# EAGLE design PracticeBoardV1 (EAGLE 8.2.2)
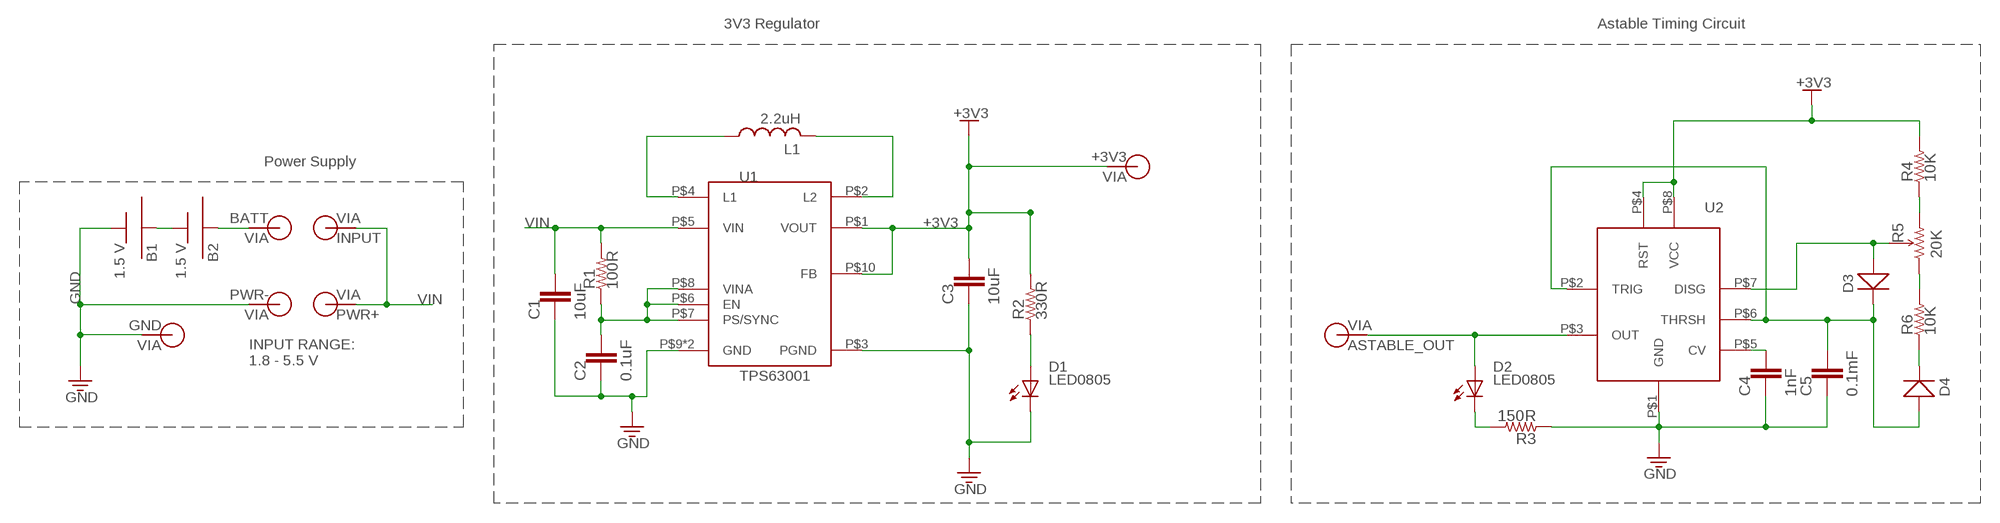
[diagram p0: schematic, sheet 1, part 1 of 2]
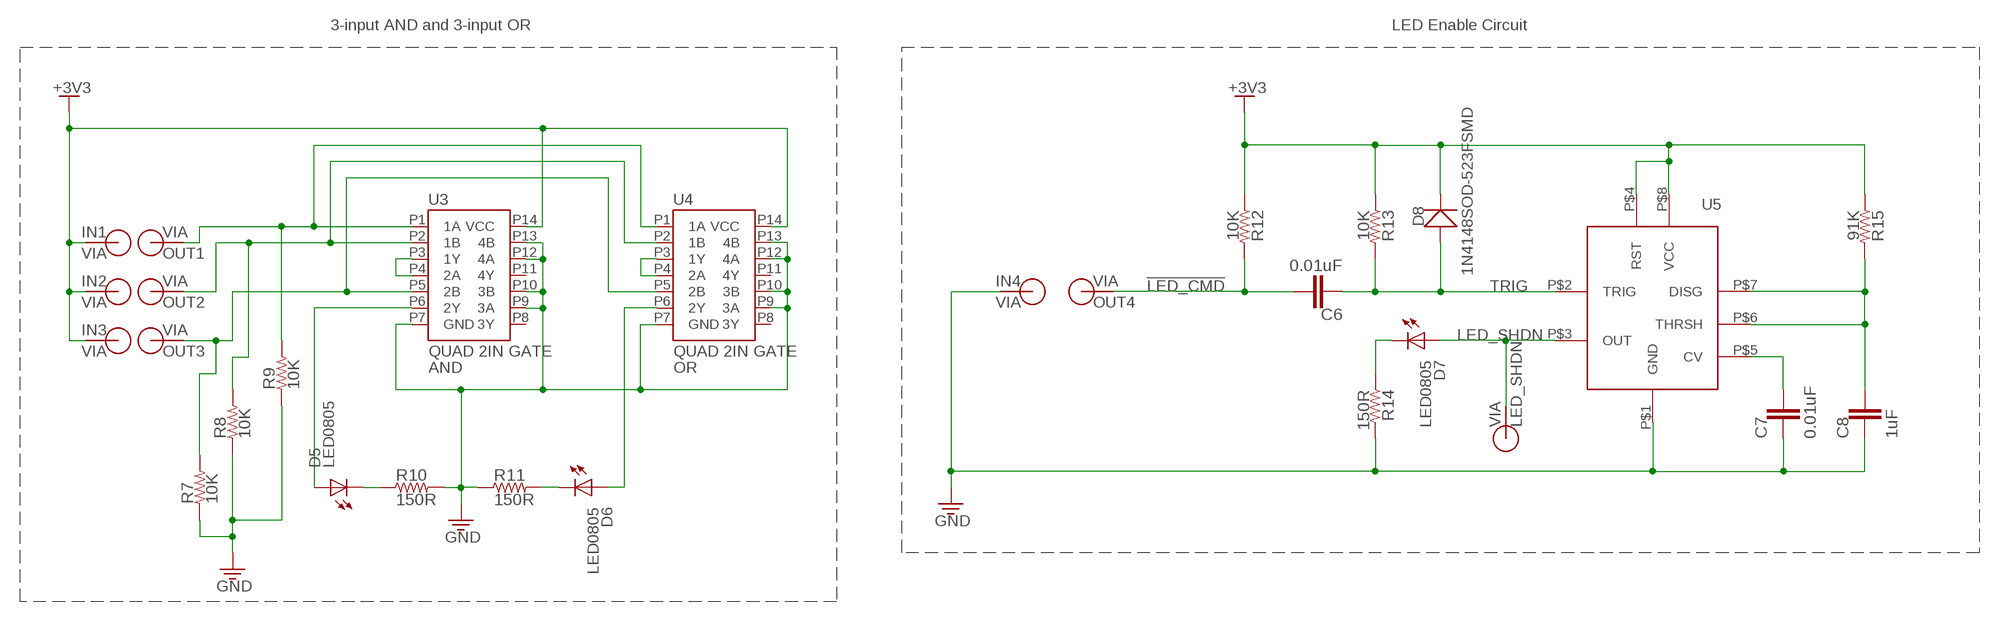
[diagram p1: schematic, sheet 1, part 2 of 2]

## Parts
B1  1.5 V  BCAAPC-BATT-HOLDER  [BCAAPC-BATT-HOLDER]
B2  1.5 V  BCAAPC-BATT-HOLDER  [BCAAPC-BATT-HOLDER]
C1  10uF  CAP0805  [0805]
C2  0.1uF  CAP0805  [0805]
C3  10uF  CAP0805  [0805]
C4  1nF  CAP0805  [0805]
C5  0.1mF  CAP0805  [0805]
C6  0.01uF  CAP0805  [0805]
C7  0.01uF  CAP0805  [0805]
C8  1uF  CAP0805  [0805]
D1  LED0805  [0805-D]
D2  LED0805  [0805-D]
D3  1N4148THRU-HOLE  [1N4148]
D4  1N4148THRU-HOLE  [1N4148]
D5  LED0805  [0805-D]
D6  LED0805  [0805-D]
D7  LED0805  [0805-D]
D8  1N4148SOD-523FSMD  [SOD-523F]
L1  2.2uH  L-USL3225M  [L3225M]
R1  100R  RES0805  [0805]
R2  330R  RES0805  [0805]
R3  150R  RES0805  [0805]
R4  10K  RES0805  [0805]
R5  20K  P160KN-0QC15B20K-POT  [P160KN]
R6  10K  RES0805  [0805]
R7  10K  RES0805  [0805]
R8  10K  RES0805  [0805]
R9  10K  RES0805  [0805]
R10  150R  RES0805  [0805]
R11  150R  RES0805  [0805]
R12  10K  RES0805  [0805]
R13  10K  RES0805  [0805]
R14  150R  RES0805  [0805]
R15  91K  RES0805  [0805]
U1  TPS63001  TPS6300X  [QFN10_POWERPAD]
U2  TLC555  [SO-8]
U3  AND  QUAD-2IN-GATE-AND-SN74AHC08RGYR  [VQFN-14]
U4  OR  QUAD-2IN-GATE-OR-SN74LV32APWRG4  [TSSOP-14]
U5  TLC555  [SO-8]
V1  BATT  VIA60MIL-SQ  [VIA-60MIL-SQ]
V2  PWR-  VIA60MIL-SQ  [VIA-60MIL-SQ]
V3  INPUT  VIA60MIL-SQ  [VIA-60MIL-SQ]
V4  PWR+  VIA60MIL-SQ  [VIA-60MIL-SQ]
V5  +3V3  VIA60MIL-SQ  [VIA-60MIL-SQ]
V6  ASTABLE_OUT  VIA60MIL-SQ  [VIA-60MIL-SQ]
V7  IN1  VIA60MIL-SQ  [VIA-60MIL-SQ]
V8  IN2  VIA60MIL-SQ  [VIA-60MIL-SQ]
V9  IN3  VIA60MIL-SQ  [VIA-60MIL-SQ]
V10  OUT1  VIA60MIL-SQ  [VIA-60MIL-SQ]
V11  OUT2  VIA60MIL-SQ  [VIA-60MIL-SQ]
V12  OUT3  VIA60MIL-SQ  [VIA-60MIL-SQ]
V13  IN4  VIA60MIL-SQ  [VIA-60MIL-SQ]
V14  OUT4  VIA60MIL-SQ  [VIA-60MIL-SQ]
V15  LED_SHDN  VIA60MIL-SQ  [VIA-60MIL-SQ]
V16  GND  VIA60MIL-SQ  [VIA-60MIL-SQ]

## Nets
!LED_CMD!: C6.1 R12.2 V14.P$1
+3V3: C3.1 D8.C R2.2 R4.2 R12.1 R13.1 R15.1 U1.P$1(VOUT) U1.P$10(FB) U2.P$4(RST) U2.P$8(VCC) U3.P14(VCC) U4.P14(VCC) U5.P$4(RST) U5.P$8(VCC) V5.P$1 V7.P$1 V8.P$1 V9.P$1
ASTABLE_OUT: D2.A U2.P$3(OUT) V6.P$1
GND: B1.MINUS C1.2 C2.2 C3.2 C4.2 C5.2 C7.2 C8.2 D1.C R3.1 R7.1 R8.1 R9.1 R10.2 R11.1 R14.2 U1.P$3(PGND) U1.P$9(GND) U1.PAD(GND) U2.P$1(GND) U3.P7(GND) U3.P9(3A) U3.P10(3B) U3.P12(4A) U3.P13(4B) U4.P7(GND) U4.P9(3A) U4.P10(3B) U4.P12(4A) U4.P13(4B) U5.P$1(GND) V2.P$1 V13.P$1 V16.P$1
LED_SHDN: D7.A U5.P$3(OUT) V15.P$1
N$1: B1.PLUS B2.MINUS
N$2: C4.1 U2.P$5(CV)
N$3: C5.1 D3.C D4.A U2.P$2(TRIG) U2.P$6(THRSH)
N$4: D5.C R10.1
N$5: L1.1 U1.P$4(L1)
N$6: L1.2 U1.P$2(L2)
N$7: R4.1 R5.P2
N$8: D6.C R11.2
N$9: C2.1 R1.1 U1.P$6(EN) U1.P$7(PS/SYNC) U1.P$8(VINA)
N$10: R9.2 U3.P1(1A) U4.P1(1A) V10.P$1
N$11: R8.2 U3.P2(1B) U4.P2(1B) V11.P$1
N$12: R7.2 U3.P5(2B) U4.P5(2B) V12.P$1
N$13: U4.P3(1Y) U4.P4(2A)
N$14: U3.P3(1Y) U3.P4(2A)
N$15: B2.PLUS V1.P$1
N$16: D3.A R5.P3 U2.P$7(DISG)
N$17: R5.P1 R6.2
N$19: D7.C R14.1
N$20: C8.1 R15.2 U5.P$6(THRSH) U5.P$7(DISG)
N$21: D5.A U3.P6(2Y)
N$22: D2.C R3.2
N$23: C7.1 U5.P$5(CV)
N$24: D6.A U4.P6(2Y)
N$25: D4.C R6.1
N$31: D1.A R2.1
TRIG: C6.2 D8.A R13.2 U5.P$2(TRIG)
VIN: C1.1 R1.2 U1.P$5(VIN) V3.P$1 V4.P$1
Unconnected: U3.P8(3Y) U3.P11(4Y) U4.P8(3Y) U4.P11(4Y)

## Notes on the sheet
- 3V3 Regulator | Astable Timing Circuit | 3-input AND and 3-input OR | LED Enable Circuit
- Power Supply
- INPUT RANGE:
  1.8 - 5.5 V

## Library data of the parts
B1 B2 = BrownSpaceEngineering:BCAAPC-BATT-HOLDER
C1-C8 = BrownSpaceEngineering:CAP: Capacitor
D1 D2 D5-D7 = BrownSpaceEngineering:LED
D3 D4 D8 = BrownSpaceEngineering:1N4148
L1 = resistor:L-US: INDUCTOR, American symbol
R1-R4 R6-R15 = BrownSpaceEngineering:RES
R5 = BrownSpaceEngineering:P160KN-0QC15B20K-POT
U1 = CNTRL_BOARD:TPS6300X
U2 U5 = BrownSpaceEngineering:TLC555
U3 U4 = BrownSpaceEngineering:QUAD-2IN-GATE
V1-V16 = BrownSpaceEngineering:VIA

## Net classes
0 default: clearance 0.205 mm

## Board
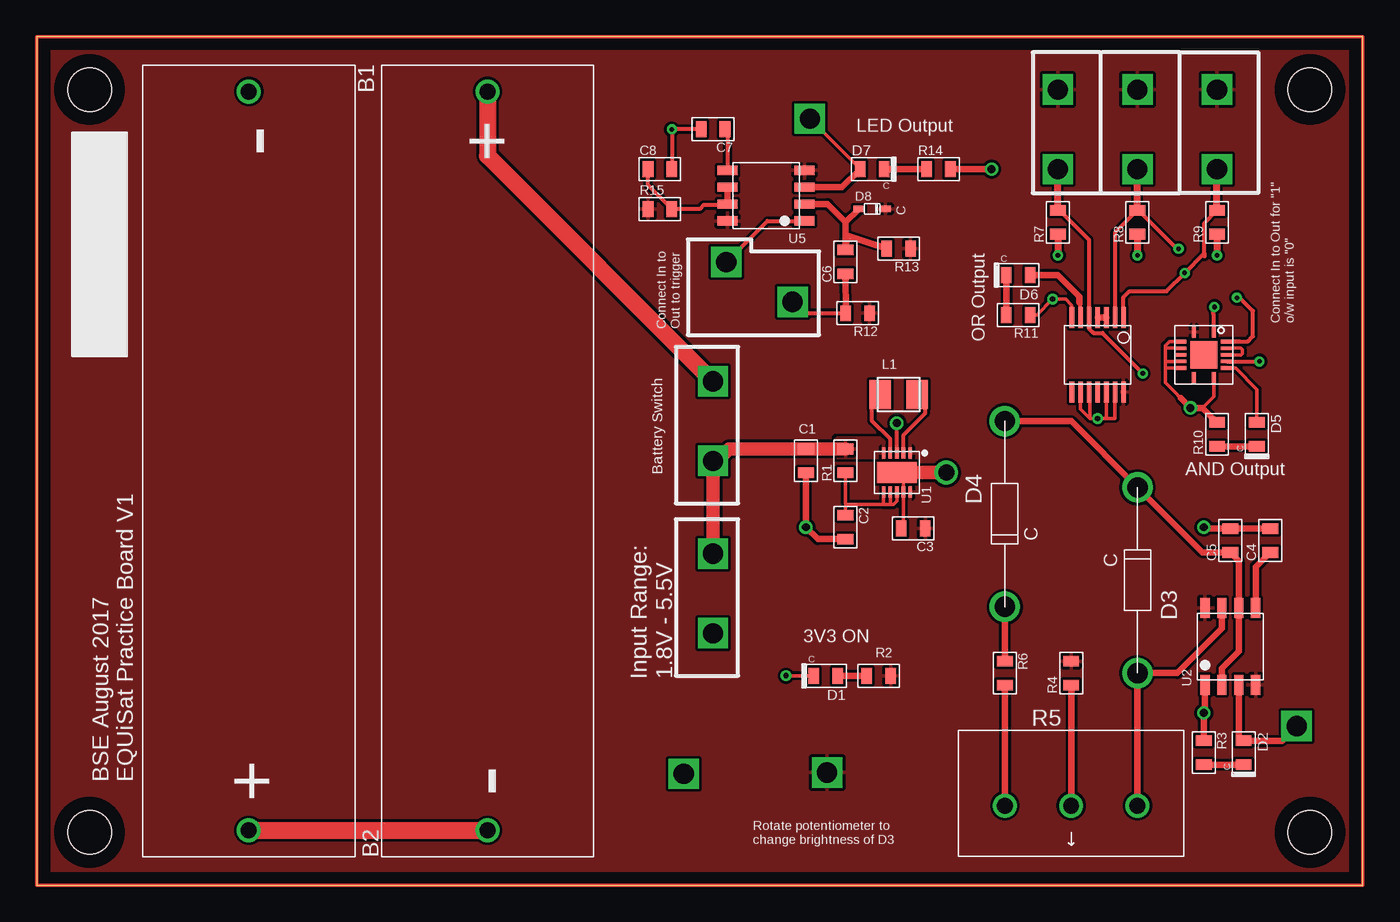
[diagram p2: board, top side]
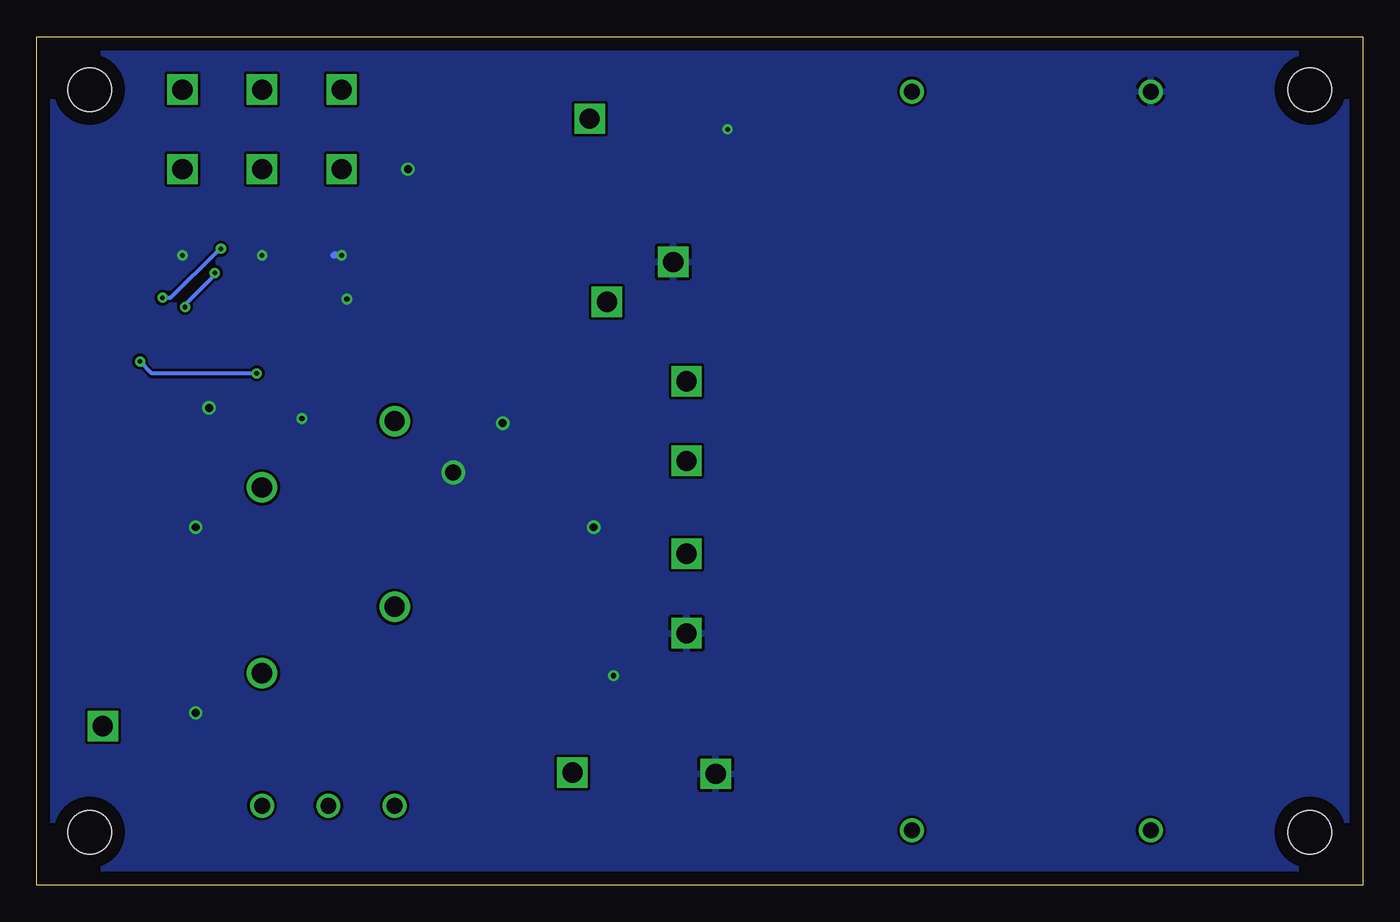
[diagram p3: board, bottom side, seen from below]

Size 100 x 64 mm. Coordinates in mm from the lower left corner, seen from the top.
Outline: 0,0 100,0 100,64 0,64 0,0
Copper layers (1*16): Top 0.035mm / dielectric 1.5mm / Bottom 0.035mm
Design rules "default": minimum track width 10mil, minimum drill 24mil, track to track 8mil, track to pad 8mil, pad to pad 8mil, via to via 8mil, smd to smd 8mil, copper to edge 40mil, drill to drill 8mil, minimum pad ring 10mil, minimum via ring 8mil, stop-mask expansion 4mil, vias tented up to drill 0mil, thermal gap 10mil
Holes 3.3 mm at 4,4 96,4 96,60 4,60

### Footprints (pad centres in the part's own frame; a part is rotated, then mirrored left to right if it is on the bottom)
BCAAPC-BATT-HOLDER = drill 1.2: MINUS -27.85,0; PLUS 27.85,0
0805 = smd 0.8 x 1.2: 1 -0.9,0; 2 0.9,0
0805-D = smd 0.8 x 1.2: A -0.9,0; C 0.9,0
1N4148 = drill 1.53: A -7,0; C 7,0
SOD-523F = smd 0.5 x 0.8: A 0,-1; C 0,1
L3225M = smd 1.6 x 2.2: 1 -1.4,0; 2 1.4,0
P160KN = drill 1.2 pad 1.8: P1 -5,0; P2 0,0; P3 5,0
QFN10_POWERPAD = smd 0.28 x 0.85: P$1 0,0; P$2 0.5,0; P$3 1,0; P$4 1.5,0; P$5 2,0; P$6 2,2.95; P$7 1.5,2.95; P$8 1,2.95; P$9 0.5,2.95; P$10 0,2.95 | smd 3 x 1.6: PAD 1,1.475
SO-8 = smd 0.7 x 1.5: P$1 -1.905,-2.9; P$2 -0.635,-2.9; P$3 0.635,-2.9; P$4 1.905,-2.9; P$5 1.905,2.9; P$6 0.635,2.9; P$7 -0.635,2.9; P$8 -1.905,2.9
VQFN-14 = smd 0.85 x 0.28: P1 -1.725,0.75; P7 1.725,0.75; P8 1.725,-0.75; P14 -1.725,-0.75 | smd 0.28 x 0.85: P2 -1,1.725; P3 -0.5,1.725; P4 0,1.725; P5 0.5,1.725; P6 1,1.725; P9 1,-1.725; P10 0.5,-1.725; P11 0,-1.725; P12 -0.5,-1.725; P13 -1,-1.725 | smd 2.05 x 2.05: PAD 0,0
TSSOP-14 = smd 0.35 x 1.6: P1 -1.95,-2.8; P2 -1.3,-2.8; P3 -0.65,-2.8; P4 0,-2.8; P5 0.65,-2.8; P6 1.3,-2.8; P7 1.95,-2.8; P8 1.95,2.8; P9 1.3,2.8; P10 0.65,2.8; P11 0,2.8; P12 -0.65,2.8; P13 -1.3,2.8; P14 -1.95,2.8
VIA-60MIL-SQ = drill 1.524 square: P$1 0,0

### Placement (x,y rotation side)
B1  16,32 270 top
B2  34,32 90 top
C1  58,32 270 top
C2  61,27 270 top
C3  66.1,26.9 180 top
C4  93,26 90 top
C5  90,26 90 top
C6  61,47 90 top
C7  51,57 180 top
C8  47,54 0 top
D1  59.5,15.8 180 top
D2  91,10 270 top
D3  83,23 90 top
D4  73,28 270 top
D5  92,34 270 top
D6  74,46 180 top
D7  63,54 0 top
D8  63,51 270 top
L1  65,37 0 top
R1  61,32 90 top
R2  63.5,15.8 0 top
R3  88,10 270 top
R4  78,16 90 top
R5  78,6 0 top
R6  73,16 270 top
R7  77,50 90 top
R8  83,50 90 top
R9  89,50 90 top
R10  89,34 90 top
R11  74,43 180 top
R12  61.91,43.13 180 top
R13  65,48 180 top
R14  68,54 0 top
R15  47,51 0 top
U1  65.86,32.6 180 top
U2  90,18 0 top
U3  88,40 270 top
U4  80,40 180 top
U5  55,52 90 top
V1  51,38 90 top
V2  51,19 90 top
V3  51,32 90 top
V4  51,25 90 top
V5  59.6,8.5 0 top
V6  95,12 270 top
V7  89,60 270 top
V8  83,60 270 top
V9  77,60 270 top
V10  89,54 270 top
V11  83,54 270 top
V12  77,54 270 top
V13  52,47 0 top
V14  57,44 0 top
V15  58.3,57.8 0 top
V16  48.8,8.4 0 top

### Tracks (layer width: path | path; a pad name or v marks a point on that pad's centre or on a via)
!LED_CMD!
  Top 0.3: V14.P$1 57.87,43.13 R12.2
  Top 0.508: R12.2 C6.1
+3V3
  pour Top (rank 4): 0,0 0,68 105,68 105,0
ASTABLE_OUT
  Top 0.508: U2.P$3 90.64,11.27 D2.A 93.9,10.9 V6.P$1
DIM-WIRE
  Top 0.254: 0,0 0,64 100,64 100,0 0,0
GND  (via drill 0.35, 0.4 pad 0.5, 0.6, 1.2)
  Top 0.254: U3.P13 85.4,41 85.1,40.7 85.1,40.45 | 85.1,39.41 85.1,40.45 | 85.1,38.92 85.1,39.41 | 85.1,38.92 85.1,37.9 v87,36 | U3.P12 85.15,40.5 85.1,40.45 | U3.P10 85.19,39.5 85.1,39.41 | U3.P9 85.18,39 85.1,38.92 | U3.P7 88.75,36.85 87.9,36 | U1.PAD 65.36,30.62 U1.P$9 65.36,27.06 C3.2 | D1.C v56.5,15.8 | U4.P9 78.7,35.9 79.4,35.2 | 79.4,35.2 79.4,37.15 U4.P10 | U4.P12 80.65,35.35 80.5,35.2 | 80.5,35.2 v80,35.2 79.4,35.2 | U4.P13 81.3,35.2 80.5,35.2 | U4.P7 78.05,43.67 78.03,43.69 78.03,43.77 77.6,44.2 v76.6,44.2 75.4,43 R11.1
  Top 0.3: V13.P$1 55.09,50.09 U5.P$1 | C7.2 v47.9,57 C8.2
  Top 0.305: U1.P$3 v64.86,34.85
  Top 0.508: C2.2 58.9,26.1 v58,27 C1.2 | R14.2 v72,54 | C4.2 C5.2 88.1,26.9 v88,27 | U2.P$1 88.09,13.1 v88,13 R3.1 | 88.75,35.15 R10.2 87.9,36 v87,36 86.28,36.73
  Top 0.51: R7.1 v77,47.5 | R8.1 v83,47.5 | R9.1 v89,47.5 | 58.7,15.7 D1.C
  Top 1.016: U1.PAD v68.58,31.11
  Bottom 0.51: v77,47.5 77.6,47.5
  pour Bottom: 0,0 0,67 106,67 106,0
LED_SHDN
  Top 0.254: D7.A V15.P$1
  Top 0.508: U5.P$3 60.73,52.63 D7.A
N$1
  Top 1.27: B1.PLUS B2.MINUS
N$2
  Top 0.508: U2.P$5 91.91,24 C4.1
N$3
  Top 0.508: U2.P$2 89.36,16.36 90.64,17.64 U2.P$6 90.64,24.46 C5.1 87.9,25.1 D3.C 78,35 D4.A
N$4
  Top 0.508: D5.C R10.1
N$5
  Top 0.305: U1.P$4 64.36,33.64 63,35 63,36.4 L1.1
N$6
  Top 0.305: U1.P$2 65.36,33.96 67,35.6 67,36.4 L1.2
N$7
  Top 0.508: R4.1 R5.P2
N$8
  Top 0.508: D6.C R11.2
N$9
  Top 0.254: U1.P$8 64.86,28.96 64.6,28.7 64.43,28.7 | 63.81,28.7 64.43,28.7 | 63.81,28.7 61.1,28.7 | 61.1,28.7 61,28.6 C2.1 | U1.P$7 64.36,28.77 64.43,28.7 | U1.P$6 63.86,28.75 63.81,28.7 | 61.1,28.7 61,28.8 R1.1
N$10  (via drill 0.35)
  Top 0.3: 88.05,47.65 88.05,47.42 | 88.05,47.65 88.05,49.95 R9.2 | U4.P1 81.95,44.35 82.4,44.8 85.19,44.8 v86.56,46.17 88.05,47.65 | U3.P1 88.75,43.05 88.7,43.1 88.7,43.5 v88.8,43.6
  Top 0.51: R9.2 V10.P$1
  Bottom 0.3: v88.8,43.6 88.8,43.8 86.5,46.1 86.6,46.2 86.59,46.2 v86.56,46.17
N$11  (via drill 0.35)
  Top 0.3: U4.P2 81.3,49.2 R8.2 | 90.7,41 U3.P2 91.3,41 91.7,41.4 91.7,43.3 90.8,44.2 90.6,44.2 v90.5,44.3 | v86.1,48 85.98,48 83,50.98
  Top 0.51: V11.P$1 83,50.98 R8.2
  Bottom 0.3: v90.5,44.3 89.9,44.3 86.4,47.8 86.3,47.8 v86.1,48
N$12  (via drill 0.35)
  Top 0.3: 77,51.03 79.35,48.68 U4.P5 79.35,41.98 79.68,41.65 80.35,41.65 v83.4,38.6 | U3.P5 v92.2,39.5
  Top 0.51: V12.P$1 77,51.03 R7.2
  Bottom 0.3: v83.4,38.6 91.3,38.6 v92.2,39.5
N$13
  Top 0.508: U4.P4 U4.P3
N$14
  Top 0.254: U3.P4 90.8,40 90.9,40.1 90.9,40.4 90.8,40.5 U3.P3
N$15
  Top 1.27: B2.PLUS 34,55 V1.P$1
N$16
  Top 0.508: U2.P$7 89.36,19.36 86,16 D3.A R5.P3
N$17
  Top 0.508: R6.2 R5.P1
N$19
  Top 0.508: D7.C R14.1
N$20
  Top 0.3: U5.P$7 52.03,51.3 50.3,51.3 50,51 R15.2 46.1,52.8 C8.1
  Top 0.508: U5.P$6 U5.P$7
N$21
  Top 0.254: U3.P6 90.4,39 92,37.4 D5.A
N$22
  Top 0.508: D2.C R3.2
N$23
  Top 0.3: C7.1 52.1,56.8 U5.P$5
N$24
  Top 0.305: U4.P6 78.7,43.85 78.62,43.93
  Top 0.508: 78.62,43.93 78.62,44.38 77,46 D6.A
N$25
  Top 0.508: R6.1 D4.C
N$31
  Top 0.508: R2.1 D1.A
TRIG
  Top 0.508: U5.P$2 59.63,51.37 61,50 | 61,50 D8.A | 61,50 C6.2 61.1,49 R13.2
VIN
  Top 1.016: R1.2 C1.1 52.22,32.9 51,31.68 | 51,31.68 V4.P$1 | 51,31.68 V3.P$1
  pour Top: 64.1,32.2 64.1,33.5 63.8,33.8 60.4,33.8 60.2,33.6 60.2,32.4 60.4,32.2

### Text on the board
tPlace: LED Output | Connect In to / Out to trigger | Connect In to Out for "1" / o/w input is "0" | OR Output | Battery Switch | AND Output | 3V3 ON | Input Range: / 1.8V - 5.5V | BSE August 2017 / EQUiSat Practice Board V1 | Rotate potentiometer to / change brightness of D3